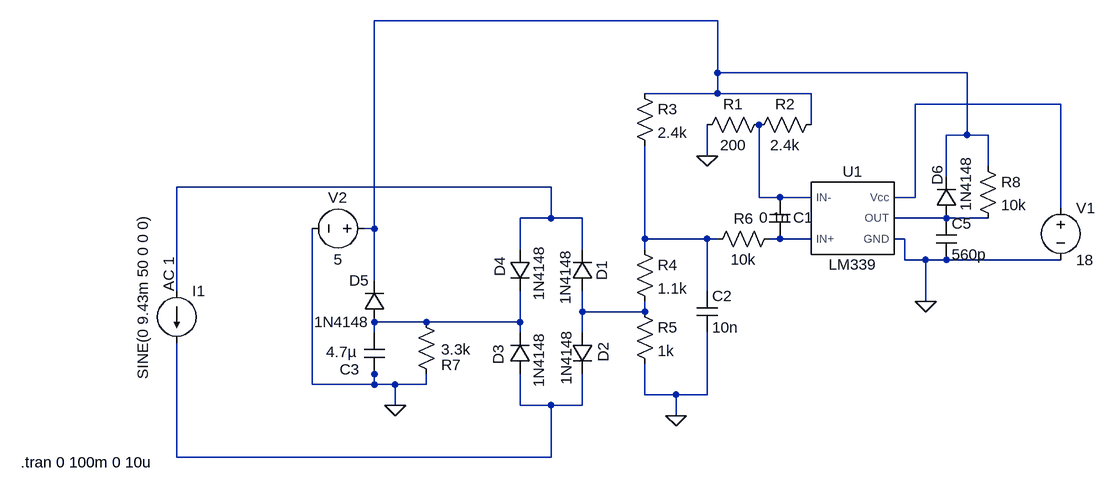
[diagram p0: schematic Draft1.asc]
Draft1.asc, the LTspice schematic file:
Version 4.1
SHEET 1 880 680
WIRE -32 -128 -560 -128
WIRE -32 -48 -32 -128
WIRE 352 -48 -32 -48
WIRE -32 -16 -32 -48
WIRE -32 -16 -144 -16
WIRE 112 -16 -32 -16
WIRE 496 0 272 0
WIRE 112 32 112 -16
WIRE 352 48 352 -48
WIRE 352 48 320 48
WIRE 384 48 352 48
WIRE -48 80 -48 32
WIRE 384 96 384 48
WIRE 320 112 320 48
WIRE -288 128 -864 128
WIRE 32 144 32 32
WIRE 64 144 32 144
WIRE 112 144 64 144
WIRE 272 144 272 0
WIRE 272 144 240 144
WIRE 496 160 496 0
WIRE -288 176 -288 128
WIRE -288 176 -336 176
WIRE -240 176 -288 176
WIRE 320 176 240 176
WIRE 384 176 320 176
WIRE -560 192 -560 -128
WIRE -560 192 -576 192
WIRE -144 208 -144 64
WIRE -48 208 -144 208
WIRE -32 208 -48 208
WIRE 64 208 48 208
WIRE 112 208 64 208
WIRE 256 208 240 208
WIRE -336 224 -336 176
WIRE -240 224 -240 176
WIRE -144 224 -144 208
WIRE 256 240 256 208
WIRE 288 240 256 240
WIRE 320 240 288 240
WIRE 496 240 320 240
WIRE -560 272 -560 192
WIRE -864 288 -864 128
WIRE -48 288 -48 208
WIRE 288 304 288 240
WIRE -240 320 -240 288
WIRE -144 320 -144 304
WIRE -144 320 -240 320
WIRE -480 336 -560 336
WIRE -336 336 -336 288
WIRE -336 336 -480 336
WIRE -560 352 -560 336
WIRE -336 352 -336 336
WIRE -240 352 -240 320
WIRE -560 416 -560 400
WIRE -656 432 -656 192
WIRE -560 432 -560 416
WIRE -560 432 -656 432
WIRE -528 432 -560 432
WIRE -480 432 -480 416
WIRE -480 432 -528 432
WIRE -144 448 -144 400
WIRE -96 448 -144 448
WIRE -48 448 -48 352
WIRE -48 448 -96 448
WIRE -528 464 -528 432
WIRE -336 464 -336 416
WIRE -288 464 -336 464
WIRE -240 464 -240 416
WIRE -240 464 -288 464
WIRE -96 480 -96 448
WIRE -864 544 -864 368
WIRE -288 544 -288 464
WIRE -288 544 -864 544
FLAG -48 80 0
FLAG -96 480 0
FLAG -528 464 0
FLAG 288 304 0
SYMBOL LM339 176 176 R0
SYMATTR InstName U1
SYMBOL cap 48 144 R0
WINDOW 0 36 31 Left 2
WINDOW 3 -16 31 Left 2
SYMATTR InstName C1
SYMATTR Value 0.1n
SYMBOL res 48 16 R90
WINDOW 0 0 56 VBottom 2
WINDOW 3 32 56 VTop 2
SYMATTR InstName R1
SYMATTR Value 200
SYMBOL res 128 16 R90
WINDOW 0 0 56 VBottom 2
WINDOW 3 32 56 VTop 2
SYMATTR InstName R2
SYMATTR Value 2.4k
SYMBOL res -160 -32 R0
SYMATTR InstName R3
SYMATTR Value 2.4k
SYMBOL res -160 208 R0
SYMATTR InstName R4
SYMATTR Value 1.1k
SYMBOL res -160 304 R0
SYMATTR InstName R5
SYMATTR Value 1k
SYMBOL cap -64 288 R0
SYMATTR InstName C2
SYMATTR Value 10n
SYMBOL res 64 192 R90
WINDOW 0 0 56 VBottom 2
WINDOW 3 32 56 VTop 2
SYMATTR InstName R6
SYMATTR Value 10k
SYMBOL diode -224 288 R180
WINDOW 0 -14 15 VRight 2
WINDOW 3 42 -21 VRight 2
SYMATTR InstName D1
SYMATTR Value 1N4148
SYMBOL diode -256 352 R0
WINDOW 0 48 15 VRight 2
WINDOW 3 -9 -4 VRight 2
SYMATTR InstName D2
SYMATTR Value 1N4148
SYMBOL diode -320 416 R180
WINDOW 0 49 14 VRight 2
WINDOW 3 -13 -21 VRight 2
SYMATTR InstName D3
SYMATTR Value 1N4148
SYMBOL diode -352 224 R0
WINDOW 0 -15 12 VRight 2
WINDOW 3 45 -6 VRight 2
SYMATTR InstName D4
SYMATTR Value 1N4148
SYMBOL res -496 320 R0
WINDOW 0 39 82 Left 2
WINDOW 3 39 58 Left 2
SYMATTR InstName R7
SYMATTR Value 3.3k
SYMBOL cap -576 352 R0
WINDOW 0 -37 57 Left 2
WINDOW 3 -58 30 Left 2
SYMATTR InstName C3
SYMATTR Value 4.7µ
SYMBOL cap 304 176 R0
SYMATTR InstName C5
SYMATTR Value 560p
SYMBOL diode 336 176 R180
WINDOW 0 30 50 VRight 2
WINDOW 3 -14 11 VRight 2
SYMATTR InstName D6
SYMATTR Value 1N4148
SYMBOL res 368 80 R0
SYMATTR InstName R8
SYMATTR Value 10k
SYMBOL current -864 288 R0
WINDOW 3 -52 -118 VRight 2
WINDOW 123 -12 -52 VRight 2
WINDOW 39 0 0 Left 0
SYMATTR Value SINE(0 9.43m 50 0 0 0)
SYMATTR Value2 AC 1
SYMATTR InstName I1
SYMBOL voltage -560 192 R90
WINDOW 0 -32 56 VBottom 2
WINDOW 3 32 56 VTop 2
WINDOW 123 0 0 Left 0
WINDOW 39 0 0 Left 0
SYMATTR InstName V2
SYMATTR Value 5
SYMBOL diode -544 336 R180
WINDOW 0 24 64 Left 2
WINDOW 3 24 0 Left 2
SYMATTR InstName D5
SYMATTR Value 1N4148
SYMBOL voltage 496 144 R0
WINDOW 123 0 0 Left 0
WINDOW 39 0 0 Left 0
SYMATTR InstName V1
SYMATTR Value 18
TEXT -1104 552 Left 2 !.tran 0 100m 0 10u

The netlist it stands for:
* Draft1.asc
X§U1 N007 N004 N002 0 N005 LM339  ; pins IN+ IN- Vcc GND OUT
C1 N004 N007 0.1n
R1 N004 0 200
R2 N001 N004 2.4k
R3 N001 N006 2.4k
R4 N006 N008 1.1k
R5 N008 0 1k
C2 N006 0 10n
R6 N007 N006 10k
D1 N008 N003 1N4148
D2 N008 N010 1N4148
D3 N010 N009 1N4148
D4 N003 N009 1N4148
R7 N009 0 3.3k
C3 N009 0 4.7µ
C5 N005 0 560p
D6 N005 N001 1N4148
R8 N001 N005 10k
I1 N003 N010 SINE(0 9.43m 50 0 0 0) AC 1
V2 N001 0 5
D5 N009 N001 1N4148
V1 N002 0 18
.model D D
.lib standard.dio
.tran 0 100m 0 10u
.lib lm2901.lib
.backanno
.end